# Altium schematic sheet Morpheus_pill.SchDoc: Pill Motion Detector
size Letter; DrawnBy: Dyke Shaffer; Organization: Hello Inc.; Revision: DVT; SheetNumber: 1; SheetTotal: 4
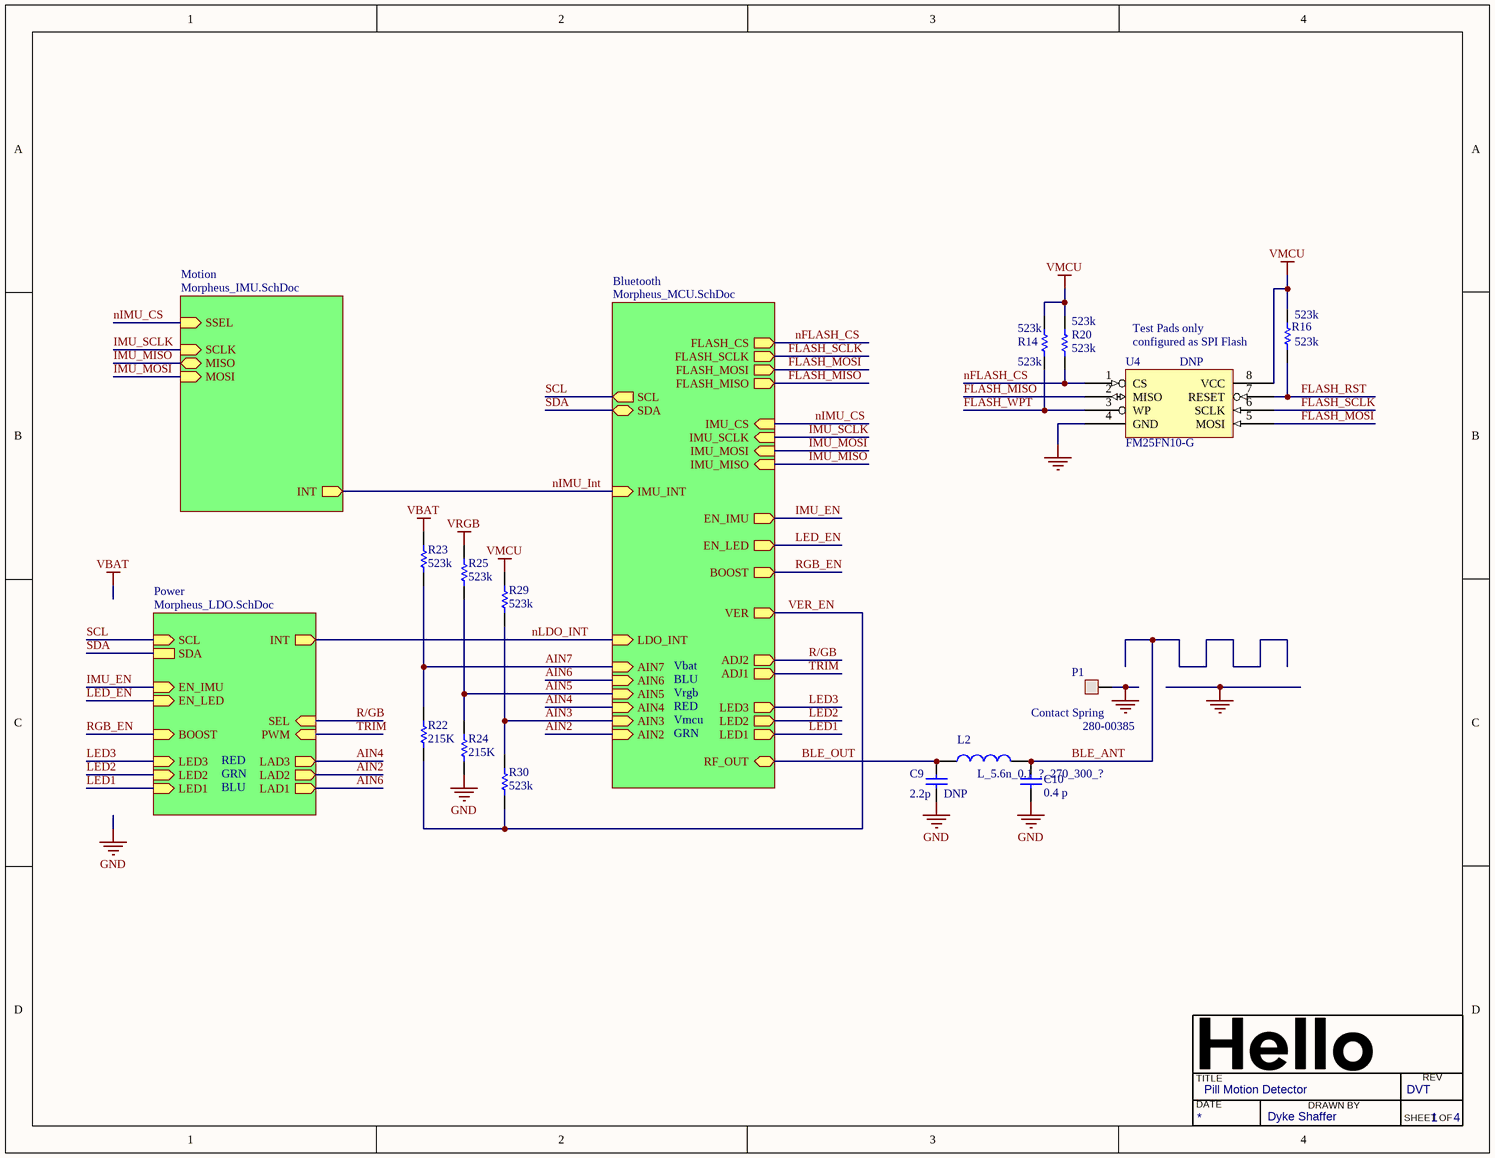
[diagram p0: Morpheus_pill.SchDoc]

## Parts
C9  DNP  value 2.2p  [CAP0201_SENSE_DVT]
C10  value 0.4 p  [CAP0201_SENSE_DVT]  (hidden comment: C_0.4p_5_25_NP0_0201)
L2  L_5.6n_0.1_?_270_300_?  [IND_0402]
P1  Contact Spring  Hello_PN: 280-00385  [TP120X70SC]
R14  523k  [RES0402_SENSE_DVT]
R16  523k  [RES0402_SENSE_DVT]
R20  523k  [RES0402_SENSE_DVT]
R22  215K  [RES0402_SENSE_DVT]
R23  523k  [RES0402_SENSE_DVT]
R24  215K  [RES0402_SENSE_DVT]
R25  523k  [RES0402_SENSE_DVT]
R29  523k  [RES0402_SENSE_DVT]
R30  523k  [RES0402_SENSE_DVT]
U4  DNP  PN: FM25FN10-G  [DFN127P600x500x80-8D]

## Sub-sheets
Bluetooth = Morpheus_MCU.SchDoc: FLASH_SCLK (out), FLASH_CS (out), IMU_INT (in), LED3 (out), EN_IMU (out), AIN6 (in), LDO_INT (in), SCL (out), SDA, AIN7 (in), EN_LED (out), AIN4 (in), AIN5 (in), AIN2 (in), AIN3 (in), RF_OUT, ADJ2 (out), ADJ1 (out), LED2 (out), LED1 (out), BOOST (out), VER (out), IMU_MISO (in), IMU_SCLK (in), IMU_MOSI (in), IMU_CS (in), FLASH_MOSI (out), FLASH_MISO (out)
Motion = Morpheus_IMU.SchDoc: MOSI (in), MISO, SCLK (in), INT (out), SSEL (in)
Power = Morpheus_LDO.SchDoc: SDA, INT (out), SCL (in), LAD3 (out), LAD2 (out), LAD1 (out), SEL (in), EN_LED (in), EN_IMU (in), BOOST (in), PWM (in), LED3 (in), LED2 (in), LED1 (in)

## Nets
GND: C9.2 C10.2 P1.1 R24.1 U4.4(GND)
VBAT: R23.2
VMCU: R14.2 R16.2 R20.2 R29.2 U4.8(VCC)
VRGB: R25.2
AIN2: sheet Bluetooth/AIN2, sheet Power/LAD2
AIN3: R29.1 R30.2 ; sheet Bluetooth/AIN3
AIN4: sheet Bluetooth/AIN4, sheet Power/LAD3
AIN5: R24.2 R25.1 ; sheet Bluetooth/AIN5
AIN6: sheet Bluetooth/AIN6, sheet Power/LAD1
AIN7: R22.2 R23.1 ; sheet Bluetooth/AIN7
BLE_ANT: C10.1 L2.2
BLE_OUT: C9.1 L2.1 ; sheet Bluetooth/RF_OUT
FLASH_MISO: U4.2(MISO) ; sheet Bluetooth/FLASH_MISO
FLASH_MOSI: U4.5(MOSI) ; sheet Bluetooth/FLASH_MOSI
FLASH_RST: R16.1 U4.7(RESET)
FLASH_SCLK: U4.6(SCLK) ; sheet Bluetooth/FLASH_SCLK
FLASH_WPT: R14.1 U4.3(WP)
IMU_EN: sheet Bluetooth/EN_IMU, sheet Power/EN_IMU
IMU_MISO: sheet Bluetooth/IMU_MISO, sheet Motion/MISO
IMU_MOSI: sheet Bluetooth/IMU_MOSI, sheet Motion/MOSI
IMU_SCLK: sheet Bluetooth/IMU_SCLK, sheet Motion/SCLK
LED1: sheet Bluetooth/LED1, sheet Power/LED1
LED2: sheet Bluetooth/LED2, sheet Power/LED2
LED3: sheet Bluetooth/LED3, sheet Power/LED3
LED_EN: sheet Bluetooth/EN_LED, sheet Power/EN_LED
nFLASH_CS: R20.1 U4.1(CS) ; sheet Bluetooth/FLASH_CS
nIMU_CS: sheet Bluetooth/IMU_CS, sheet Motion/SSEL
nIMU_Int: sheet Bluetooth/IMU_INT, sheet Motion/INT
nLDO_INT: sheet Bluetooth/LDO_INT, sheet Power/INT
R/GB: sheet Bluetooth/ADJ2, sheet Power/SEL
RGB_EN: sheet Bluetooth/BOOST, sheet Power/BOOST
SCL: sheet Bluetooth/SCL, sheet Power/SCL
SDA: sheet Bluetooth/SDA, sheet Power/SDA
TRIM: sheet Bluetooth/ADJ1, sheet Power/PWM
VER_EN: R22.1 R30.1 ; sheet Bluetooth/VER

## Notes on the sheet
- Test Pads only
- (near R16) configured as SPI Flash
- BLU
- Vbat
- Vrgb
- GRN
- RED
- Vmcu
- TITLE
- DATE
- DRAWN BY
- REV
- SHEET
- OF

## Library data of the parts
C9 = C_2.2p_5_25_C0G_0201: Chip capacitor; Vendor: TDK; PN: C0603C0G1E2R2B030BG; Tolerance: 5%; Voltage: 25V; Temp: C0G; Size: 0201
C10 = C_0.4p_5_25_NP0_0201: CAP CER 0.4PF 25V NP0 0201; Vendor: Murata; PN: GJM0335C1ER40WB01D; Tolerance: 5 %; Hello_PN: 225-00473; item_category: Capacitor; Size: 0201; Voltage: 25 V; Temp: NP0
L2 = L_5.6n_0.1_?_270_300_?: SMD RF inductor 2.2nH; PN: L-07C5N6SV6T; Vendor: Johanson; Tolerance: 0.1; RDC: 270; I_max: 300mA; Value: 5.6n; Hello_PN: 230-00394; Q: ?; I_sat: ?; item_category: Inductor
P1 = TP-120X70-SC: 3100069=SEALEDFINGR1715EMBOS; Vendor: TE Connectivity; PN: 3100069
R14 R16 R20 R23 R25 R29 R30 = R_523k_1_0.1_0402: RES 523K OHM 1/10W 1% 0402 SMD; Vendor: Panasonic; Power: 0.1 W; PN: ERJ-2RKF5233X; Hello_PN: 220-00165; item_category: Resistor; Model: *; Value: 523k; Tolerance: 1 %; Size: 0402
R22 R24 = R_215K_1_0.1_0402: RES 215K OHM 1/10W 1% 0402 SMD; Vendor: Panasonic; Power: 0.1 W; PN: ERJ-2RKF2153X; Hello_PN: 220-00301; item_category: Resistor; Model: *; Value: 215K; Tolerance: 1 %; Size: 0402
U4 = FM25VN10-G: Cypress SPI FRAM 128Kx8; Vendor: Fujitsu